# EAGLE design carry-block (EAGLE 7.6.0)
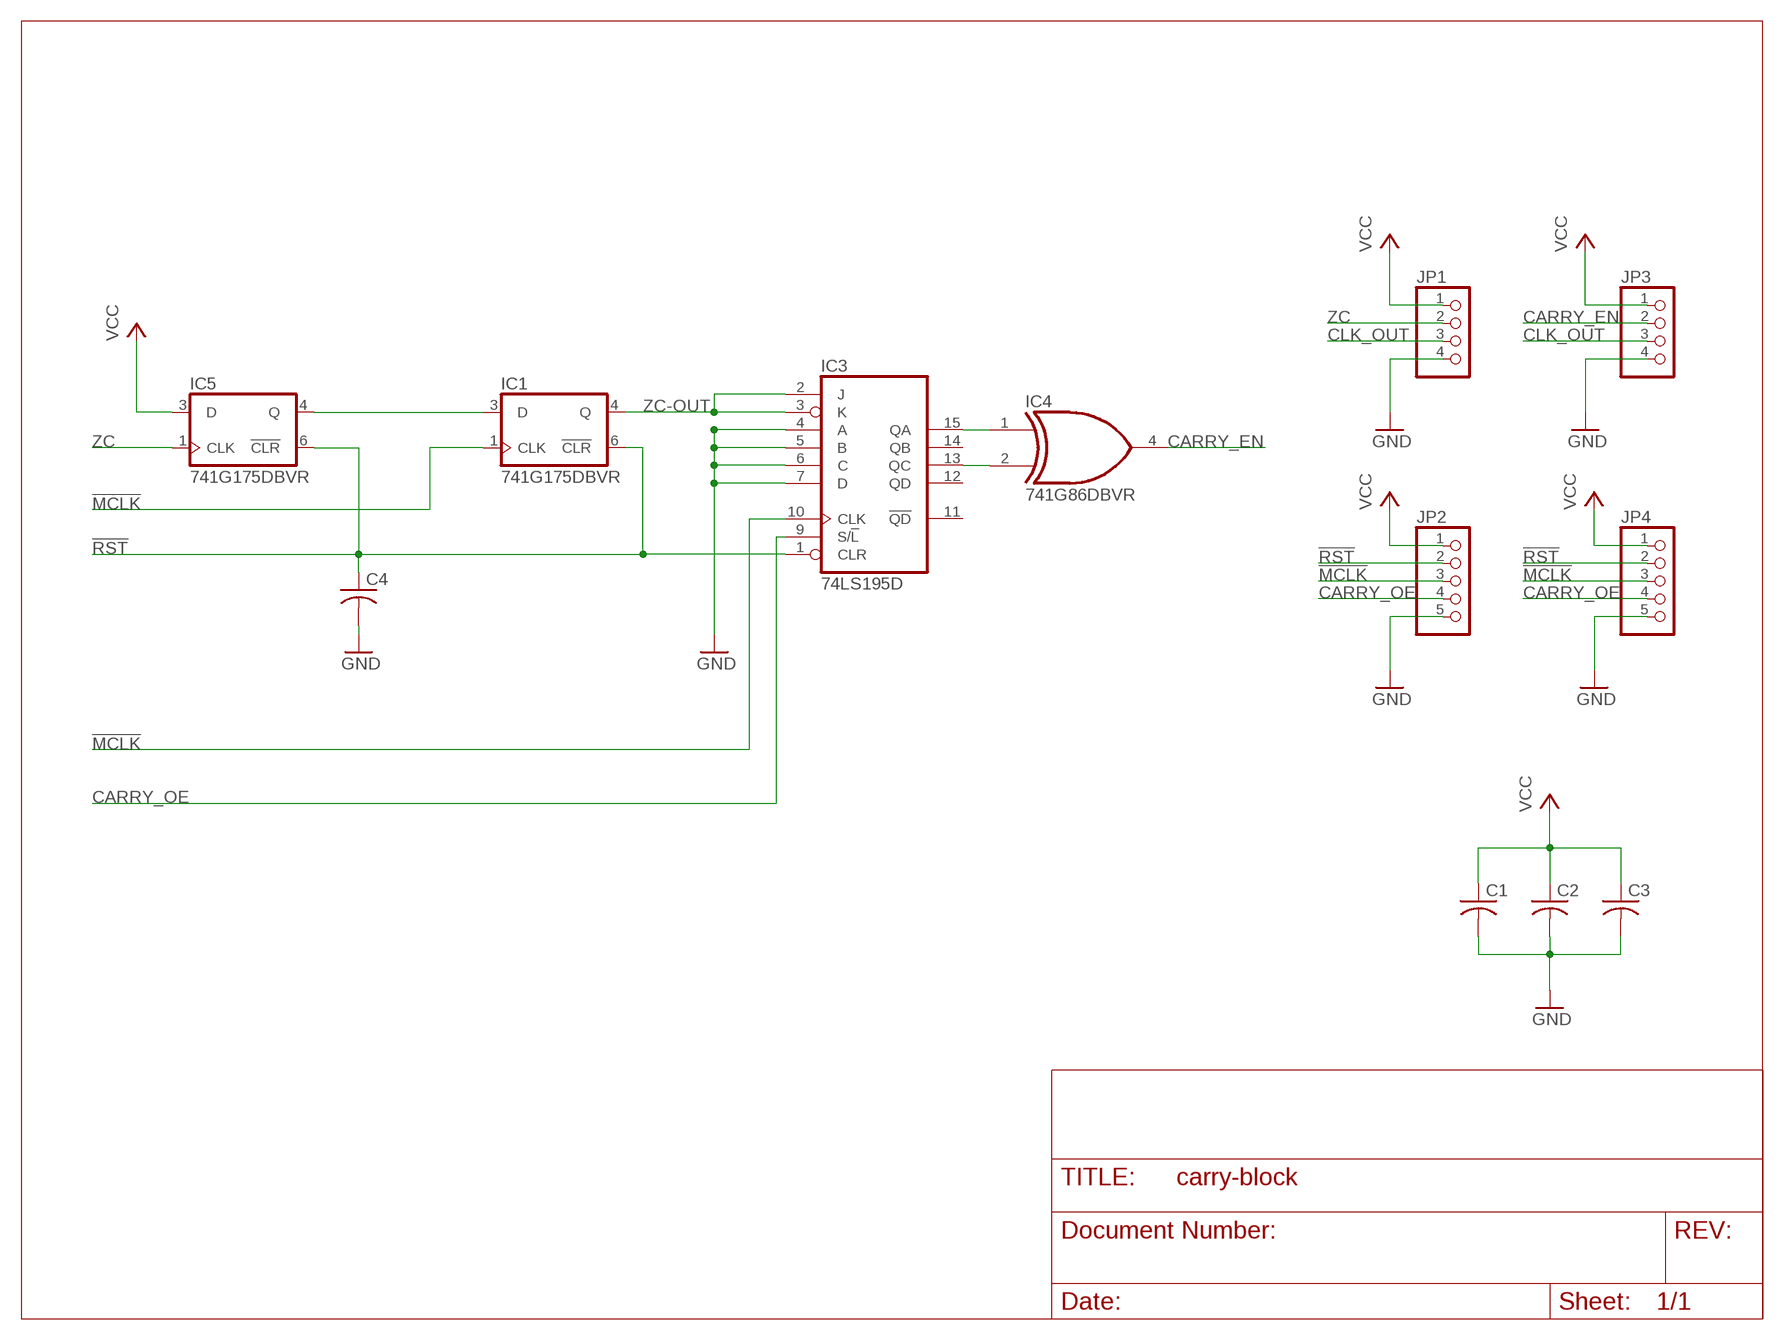
[diagram p0: schematic, sheet 1]

## Parts
C1  C-USC0603K  [C0603K]
C2  C-USC0603K  [C0603K]
C3  C-USC0603K  [C0603K]
C4  C-USC0603K  [C0603K]
IC1  741G175DBVR  741G175  [DBV_R-PDSO-G6]
IC3  74LS195D  [SO16]
IC4  741G86DBVR  74AHC1G86DBV  [SOT23-5]
IC5  741G175DBVR  741G175  [DBV_R-PDSO-G6]
JP1  PINHD-1X4  [1X04]
JP2  PINHD-1X5  [1X05]
JP3  PINHD-1X4  [1X04]
JP4  PINHD-1X5  [1X05]

## Nets
!MCLK: IC1.1(CLK) IC3.10(CLK) JP2.3 JP4.3
!RST: C4.1 IC1.6(!CLR) IC3.1(CLR) IC5.6(!CLR) JP2.2 JP4.2
CARRY_EN: IC4.4(O) JP3.2
CARRY_OE: IC3.9(S/!L) JP2.4 JP4.4
CLK_OUT: JP1.3 JP3.3
GND: C1.2 C2.2 C3.2 C4.2 IC3.4(A) IC3.5(B) IC3.6(C) IC3.7(D) JP1.4 JP2.5 JP3.4 JP4.5
N$1: IC3.15(QA) IC4.1(I0)
N$2: IC3.13(QC) IC4.2(I1)
N$5: IC1.3(D) IC5.4(Q)
VCC: C1.1 C2.1 C3.1 IC5.3(D) JP1.1 JP2.1 JP3.1 JP4.1
ZC: IC5.1(CLK) JP1.2
ZC-OUT: IC1.4(Q) IC3.2(J) IC3.3(K)
Unconnected: IC3.11(!QD) IC3.12(QD) IC3.14(QB)

## Power pins joined to a net without a drawn wire
GND: IC1.2(GND) IC3.8(GND) IC4.3(GND) IC5.2(GND)
VCC: IC1.5(VCC) IC3.16(VCC) IC4.5(VCC) IC5.5(VCC)

## Library data of the parts
C1-C4 = resistor:C-US: CAPACITOR, American symbol
IC1 IC5 = witch-e:74*1G175
IC3 = 74xx-us:74*195: 4-bit parallel access SHIFT REGISTER
IC4 = 74xx-little-us:74*1G86: 2-input EXCLUSIV-OR gate
JP1 JP3 = pinhead:PINHD-1X4: PIN HEADER
JP2 JP4 = pinhead:PINHD-1X5: PIN HEADER

## Board
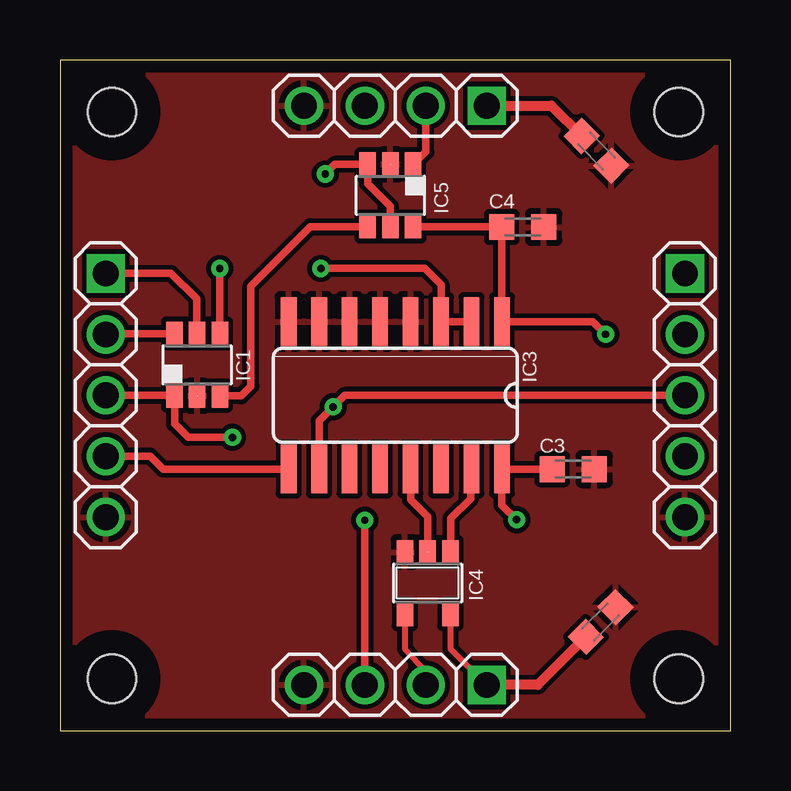
[diagram p1: board, top side]
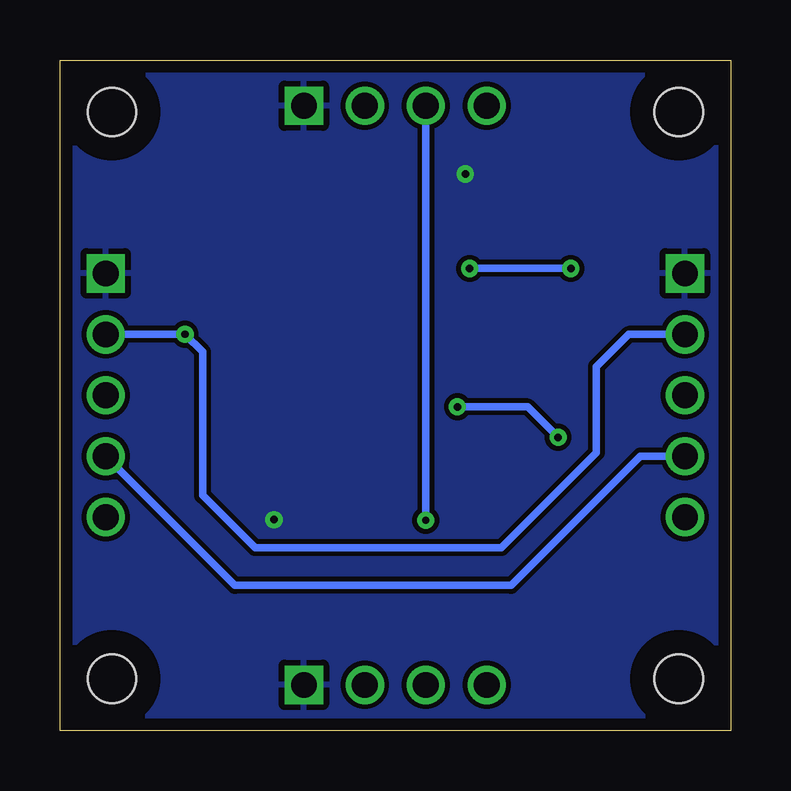
[diagram p2: board, bottom side, seen from below]

Size 27.94 x 27.94 mm. Coordinates in mm from the lower left corner, seen from the top.
Outline: 27.94,27.94 0,27.94 0,0 27.94,0 27.94,27.94
Copper layers (1*16): Top 0.035mm / dielectric 1.5mm / Bottom 0.035mm
Design rules "default *": minimum track width 8mil, minimum drill 12mil, track to track 8mil, track to pad 8mil, pad to pad 8mil, via to via 8mil, smd to smd 8mil, copper to edge 20mil, drill to drill 8mil, minimum pad ring 10mil, minimum via ring 8mil, stop-mask expansion 4mil, vias tented up to drill 0mil, thermal gap 10mil
Holes 2.01 mm at 2.16,2.16 25.78,2.16 25.78,25.78 2.16,25.78
tRestrict: area 23.8,0.2 to 27.8,4.2; area 23.8,23.8 to 27.8,27.8; area 0.2,23.8 to 4.2,27.8; area 0.2,0.2 to 4.2,4.2
bRestrict: area 23.8,0.2 to 27.8,4.2; area 23.8,23.8 to 27.8,27.8; area 0.2,23.8 to 4.2,27.8; area 0.2,0.2 to 4.2,4.2

### Footprints (pad centres in the part's own frame; a part is rotated, then mirrored left to right if it is on the bottom)
C0603K = smd 1.05 x 1.08: 1 -0.875,0; 2 0.875,0
DBV_R-PDSO-G6 = smd 0.69 x 0.99: 1 -0.95,-1.29; 2 0,-1.29; 3 0.95,-1.29; 4 0.95,1.3; 5 0,1.3; 6 -0.95,1.3
SO16 = smd 0.66 x 2.032: 1 -4.445,-3.073; 2 -3.175,-3.073; 3 -1.905,-3.073; 4 -0.635,-3.073; 5 0.635,-3.073; 6 1.905,-3.073; 7 3.175,-3.073; 8 4.445,-3.073; 9 4.445,3.073; 10 3.175,3.073; 11 1.905,3.073; 12 0.635,3.073; 13 -0.635,3.073; 14 -1.905,3.073; 15 -3.175,3.073; 16 -4.445,3.073
SOT23-5 = smd 0.69 x 0.99: 1 -0.95,-1.29; 2 0,-1.29; 3 0.95,-1.29; 4 0.95,1.3; 5 -0.95,1.3
1X04 = drill 1.067 square: 1 -3.81,0 | drill 1.067: 2 -1.27,0; 3 1.27,0; 4 3.81,0
1X05 = drill 1.067 square: 1 -5.08,0 | drill 1.067: 2 -2.54,0; 3 0,0; 4 2.54,0; 5 5.08,0

### Placement (x,y rotation side)
C1  22.53,4.52 45 top
C2  22.35,24.16 315 top
C3  21.39,10.9 0 top
C4  19.28,20.98 0 top
IC1  5.71,15.24 0 top
IC3  13.97,13.97 180 top
IC4  15.32,6.15 180 top
IC5  13.77,22.3 180 top
JP1  13.97,26.04 180 top
JP2  1.91,13.97 270 top
JP3  13.97,1.91 180 top
JP4  26.04,13.97 270 top

### Tracks (layer width: path | path; a pad name or v marks a point on that pad's centre or on a via)
!MCLK  (via drill 0.3)
  Top 0.305: JP2.3 4.49,13.97 IC1.1 | 4.5,13.94 IC1.1 | JP4.3 11.86,13.97 v11.38,13.49 10.79,12.9 IC3.10 | v7.19,12.22 5.33,12.22 4.78,12.78 4.78,13.94 IC1.1
  Bottom 0.305: v7.19,12.22 8.46,13.49 v11.38,13.49
!RST  (via drill 0.3)
  Top 0.305: v22.73,16.51 22.2,17.04 IC3.1 18.41,20.97 C4.1 18.38,21 IC5.6 | IC1.6 1.94,16.54 JP2.2
  Bottom 0.305: JP2.2 4.24,16.51 5.59,15.16 5.59,11.58 9.55,7.62 19.81,7.62 22,9.8 22,15.77 v22.73,16.51 JP4.2
CARRY_EN
  Top 0.254: IC4.4 14.37,3.42 15.24,2.46 JP3.2
CARRY_OE
  Top 0.305: IC3.9 4.29,10.9 3.76,11.43 JP2.4
  Bottom 0.305: JP2.4 3.76,11.43 9.14,6.04 20.65,6.04 JP4.4
CLK_OUT  (via drill 0.3)
  Top 0.305: v12.7,8.76 JP3.3
  Bottom 0.305: 12.68,1.93 JP3.3 | JP1.3 v12.7,8.76
GND
  pour Top: 27.69,0.25 0.25,0.25 0.25,27.69 27.69,27.69
N$1
  Top 0.305: IC3.15 17.1,10.86 17.1,9.66 16.28,8.84 16.28,7.45 IC4.1
N$2
  Top 0.305: IC3.13 14.61,9.63 15.32,8.91 IC4.2
N$5
  Top 0.305: IC1.3 7.55,13.95 7.95,14.35 7.95,18.52 10.44,21 IC5.4
VCC  (via drill 0.3)
  Top 0.254: IC4.5 16.27,3.42 JP3.1
  Top 0.305: v19.02,8.79 18.41,9.4 IC3.16 C3.1 | JP2.1 4.62,19.05 5.69,17.98 5.69,16.57 IC1.5 | v11.05,23.19 11.45,23.59 IC5.3 12.82,22.79 13.77,21.84 IC5.5
  Top 0.406: JP1.1 20.47,26.04 C2.1 | C1.1 19.91,1.91 JP3.1
  Bottom 0.305: 17.75,26.01 JP1.1
  pour Bottom: 27.69,0.25 0.25,0.25 0.25,27.69 27.69,27.69
ZC
  Top 0.305: IC5.1 15.24,24.11 JP1.2
ZC-OUT  (via drill 0.3)
  Top 0.305: 17.12,17.07 IC3.2 IC3.3 15.88,18.57 15.19,19.25 v10.87,19.25 | IC1.4 6.66,16.55 v6.66,19.25
  Bottom 0.305: v6.66,19.25 v10.87,19.25

### Text on the board
Document: CARRY / UNIT